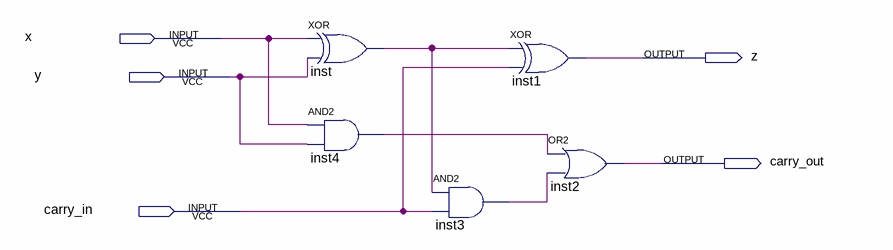
[diagram p0: schematic sheet]
// Quartus schematic ex2.bdf as structural Verilog: 5 symbols, 5 pins
module ex2 (
  input  x,
  input  y,
  input  carry_in,
  output z,
  output carry_out
);

  wire inst3_out, inst4_out, inst_out;

  xor inst (inst_out, x, y);
  and inst4 (inst4_out, x, y);
  and inst3 (inst3_out, inst_out, carry_in);
  xor inst1 (z, inst_out, carry_in);
  or inst2 (carry_out, inst4_out, inst3_out);
endmodule
